# EAGLE design tuner (EAGLE 8.2.2)
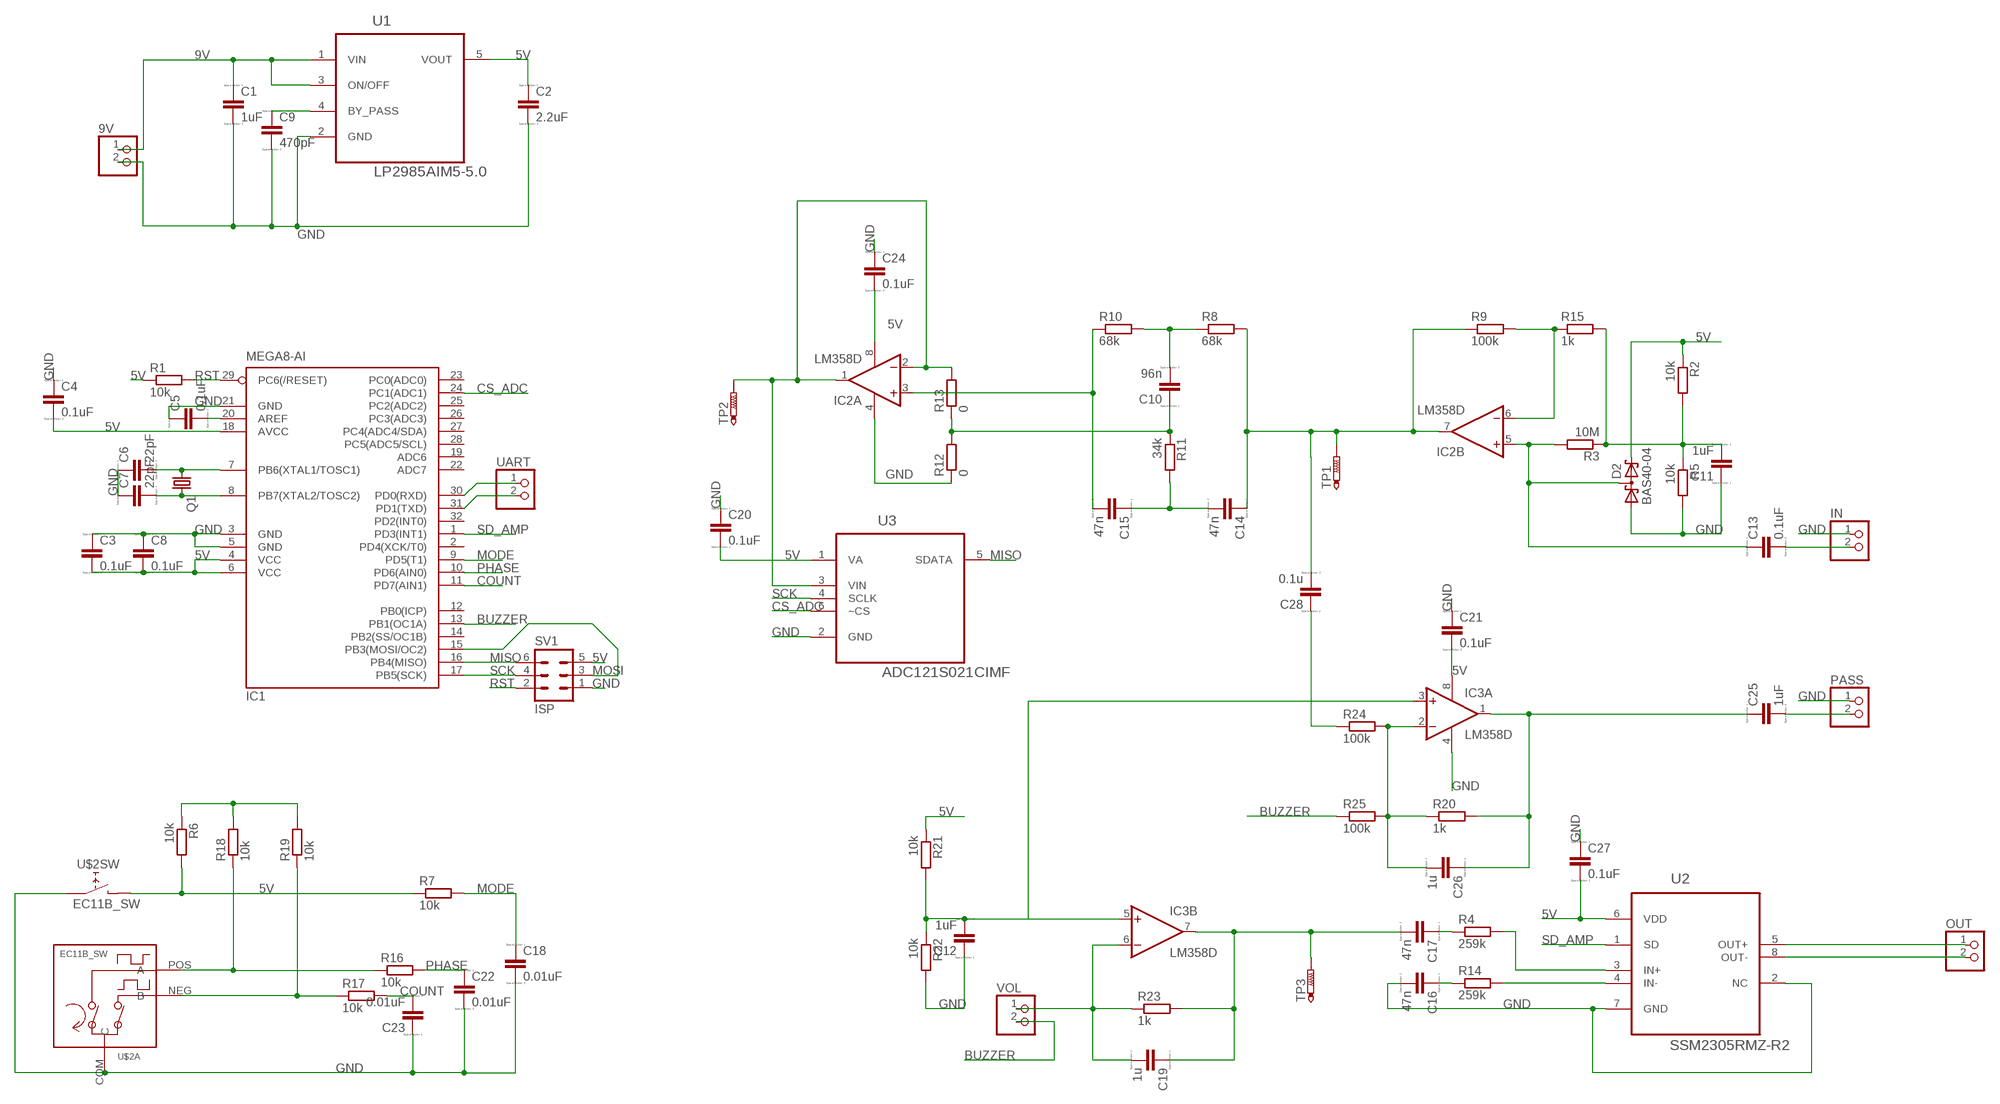
[diagram p0: schematic, sheet 1]

## Parts
9V  PINHD-1X2  [1X02]
C1  1uF  C  [C0805]
C2  2.2uF  C  [C0805]
C3  0.1uF  C  [C0805]
C4  0.1uF  C  [C0805]
C5  0.1uF  C  [C0805]
C6  22pF  C  [C0805]
C7  22pF  C  [C0805]
C8  0.1uF  C  [C0805]
C9  470pF  C  [C0805]
C10  96n  C  [C0805]
C11  1uF  C  [C0805]
C12  1uF  C  [C0805]
C13  0.1uF  C  [C0805]
C14  47n  C  [C0805]
C15  47n  C  [C0805]
C16  47n  C  [C0805]
C17  47n  C  [C0805]
C18  0.01uF  C  [C0805]
C19  1u  C  [C0805]
C20  0.1uF  C  [C0805]
C21  0.1uF  C  [C0805]
C22  0.01uF  C  [C0805]
C23  0.01uF  C  [C0805]
C24  0.1uF  C  [C0805]
C25  1uF  C  [C0805]
C26  1u  C  [C0805]
C27  0.1uF  C  [C0805]
C28  0.1u  C  [C0805]
D2  BAS40-04  [SOT23]
IC1  MEGA8-AI  [TQFP32-08]
IC2  LM358D  [SO08]
IC3  LM358D  [SO08]
IN  PINHD-1X2  [1X02]
OUT  PINHD-1X2  [1X02]
PASS  PINHD-1X2  [1X02]
Q1  CRYSTALHC49S  [HC49/S]
R1  10k  R-EU_M0805  [M0805]
R2  10k  R-EU_M0805  [M0805]
R3  10M  R-EU_M0805  [M0805]
R4  259k  R-EU_M0805  [M0805]
R5  10k  R-EU_M0805  [M0805]
R6  10k  R-EU_M0805  [M0805]
R7  10k  R-EU_M0805  [M0805]
R8  68k  R-EU_M0805  [M0805]
R9  100k  R-EU_M0805  [M0805]
R10  68k  R-EU_M0805  [M0805]
R11  34k  R-EU_M0805  [M0805]
R12  0  R-EU_M0805  [M0805]
R13  0  R-EU_M0805  [M0805]
R14  259k  R-EU_M0805  [M0805]
R15  1k  R-EU_M0805  [M0805]
R16  10k  R-EU_M0805  [M0805]
R17  10k  R-EU_M0805  [M0805]
R18  10k  R-EU_M0805  [M0805]
R19  10k  R-EU_M0805  [M0805]
R20  1k  R-EU_M0805  [M0805]
R21  10k  R-EU_M0805  [M0805]
R22  10k  R-EU_M0805  [M0805]
R23  1k  R-EU_M0805  [M0805]
R24  100k  R-EU_M0805  [M0805]
R25  100k  R-EU_M0805  [M0805]
SV1  ISP  MA03-2  [MA03-2]
TP1  PTR1B1,27  [B1,27]
TP2  PTR1B1,27  [B1,27]
TP3  PTR1B1,27  [B1,27]
U1  LP2985AIM5-5.0  [SOT95P284X119-5N]
U2  SSM2305RMZ-R2  [SOP65P490X110-8N]
U3  ADC121S021CIMF  [SOT95P284X122-6N]
U$2  EC11B_SW  [EC11B]
UART  PINHD-1X2  [1X02]
VOL  PINHD-1X2  [1X02]

## Nets
5V: C2.1 C3.2 C4.2 C8.2 C20.2 C21.2 C24.2 C27.2 D2.2(C2) IC1.4(VCC) IC1.6(VCC) IC1.18(AVCC) IC2.8(P:V+) IC3.8(P:V+) R1.1 R2.1 R6.1 R18.2 R19.2 R21.1 SV1.5 U1.5(VOUT) U2.6(VDD) U3.1(VA)
9V: 9V.1 C1.1 U1.1(VIN) U1.3(ON/OFF)
BUZZER: IC1.13(PB1(OC1A)) R25.1 VOL.2
COUNT: C23.2 IC1.11(PD7(AIN1)) R17.2
CS_ADC: IC1.24(PC1(ADC1)) U3.6(~CS)
FG: C10.1 R11.1 R12.2 R13.1
GND: 9V.2 C1.2 C2.2 C3.1 C4.1 C5.1 C6.1 C7.1 C8.1 C9.2 C11.1 C12.1 C16.2 C18.2 C20.1 C21.1 C22.2 C23.1 C24.1 C27.1 D2.1(A1) IC1.3(GND) IC1.5(GND) IC1.21(GND) IC2.4(P:V-) IC3.4(P:V-) IN.1 PASS.1 R5.2 R12.1 R22.2 SV1.1 U1.2(GND) U2.2(NC) U2.7(GND) U3.2(GND) U$2.COM(A:C) U$2.SW1(SW:D)
MISO: IC1.16(PB4(MISO)) SV1.6 U3.5(SDATA)
MODE: C18.1 IC1.9(PD5(T1)) R7.2
MOSI: IC1.15(PB3(MOSI/OC2)) SV1.3
N$1: C28.1 R24.1
N$2: C9.1 U1.4(BY_PASS)
N$3: C5.2 IC1.20(AREF)
N$4: C6.2 IC1.7(PB6(XTAL1/TOSC1)) Q1.1
N$5: C7.2 IC1.8(PB7(XTAL2/TOSC2)) Q1.2
N$6: C17.2 C19.1 IC3.7(B:OUT) R23.2 TP3.TP
N$7: C19.2 IC3.6(B:-IN) R23.1 VOL.1
N$8: C12.2 IC3.3(A:+IN) IC3.5(B:+IN) R21.2 R22.1
N$9: OUT.1 U2.5(OUT+)
N$10: C14.1 C28.2 IC2.7(B:OUT) R8.2 R9.1 TP1.TP
N$11: OUT.2 U2.8(OUT-)
N$12: C13.2 IN.2
N$13: IC2.6(B:-IN) R9.2 R15.1
N$14: R4.2 U2.3(IN+)
N$15: C25.2 PASS.2
N$16: C13.1 D2.3(C1A2) IC2.5(B:+IN) R3.2
N$17: C11.2 R2.2 R3.1 R5.1 R15.2
N$18: C25.1 C26.1 IC3.1(A:OUT) R20.2
N$19: C14.2 C15.1 R11.2
N$20: C15.2 IC2.3(A:+IN) R10.1
N$21: R14.2 U2.4(IN-)
N$23: R16.1 R18.1 U$2.POS(A:A)
N$24: R17.1 R19.1 U$2.NEG(A:B)
N$26: IC1.30(PD0(RXD)) UART.1
N$27: C10.2 R8.1 R10.2
N$28: IC1.31(PD1(TXD)) UART.2
N$29: C16.1 R14.1
N$30: IC2.1(A:OUT) IC2.2(A:-IN) R13.2 TP2.TP U3.3(VIN)
N$31: C17.1 R4.1
N$32: C26.2 IC3.2(A:-IN) R20.1 R24.2 R25.2
N$35: R6.2 R7.1 U$2.SW2(SW:E)
PHASE: C22.1 IC1.10(PD6(AIN0)) R16.2
RST: IC1.29(PC6(/RESET)) R1.2 SV1.2
SCK: IC1.17(PB5(SCK)) SV1.4 U3.4(SCLK)
SD_AMP: IC1.1(PD3(INT1)) U2.1(SD)
Unconnected: IC1.2(PD4(XCK/T0)) IC1.12(PB0(ICP)) IC1.14(PB2(SS/OC1B)) IC1.19(ADC6) IC1.22(ADC7) IC1.23(PC0(ADC0)) IC1.25(PC2(ADC2)) IC1.26(PC3(ADC3)) IC1.27(PC4(ADC4/SDA)) IC1.28(PC5(ADC5/SCL)) IC1.32(PD2(INT0))

## Library data of the parts
9V IN OUT PASS UART VOL = pinhead:PINHD-1X2: PIN HEADER
C1-C28 = eagle-ltspice:C: CAPACITOR, European symbol; SPICEMODEL: NONE; SPICEPREFIX: C
D2 = diode:BAS40-04: Silicon Schottky Diodes General-purpose diode for high-speed switching
IC1 = atmel:MEGA8: MICROCONTROLLER 8 Kbytes FLASH, 1 kbytes SRAM, 512 bytes EEPROM, USART, 6-channel 10 bit ADC, 2-channel 8 bit ADC Pin compatible with Atmega48, ATMega88, ATMega168 Source: avr.lbr; MPN: ATMEGA8-16AU; OC_FARNELL: 9171371; OC_NEWARK: 73M8863
IC2 IC3 = linear:LM358: OP AMP also LM158; LM258; LM2904 Source: http://cache.national.com/ds/LM/LM158.pdf
Q1 = crystal:CRYSTAL: CRYSTAL; OC_FARNELL: 1667008; OC_NEWARK: unknown
R1-R25 = resistor:R-EU_: RESISTOR, European symbol
SV1 = con-lstb:MA03-2: PIN HEADER; OC_FARNELL: unknown; OC_NEWARK: unknown
TP1-TP3 = testpad:PTR1: TEST PIN
U1 = LP2985AIM5-5.0:LP2985AIM5-5.0: Drop out Regulator; AVAILABILITY: Good; DESCRIPTION: Micropower 150-mA Low-Noise Ultra-Low-Dropout Regulator in SOT-23 and DSBGA Packages 5-SOT-23 -40 to 125; MF: Texas Instruments; MP: LP2985AIM5-5.0/NOPB; PACKAGE: SOT-23-5 Texas Instruments; PRICE: 0.43 USD
U2 = SSM2305RMZ-R2:SSM2305RMZ-R2: Filterless High Efficiency Mono 2.8 W Class-D Audio Amplifier; AVAILABILITY: Warning; DESCRIPTION: IC AMP AUDIO 2.8W MONO D 8MSOP; MF: Analog Devices; MP: SSM2305RMZ-R2; PACKAGE: MSOP-8 Analog Devices; PRICE: 1.47 USD
U3 = ADC121S021CIMF:ADC121S021CIMF: A/D Converters; AVAILABILITY: Good; DESCRIPTION: ADC 12BIT 1CH 50-200KSPS SOT23-6; MF: Texas Instruments; MP: ADC121S021CIMF/NOPB; PACKAGE: SOT-23 Texas Instruments; PRICE: 2.19 USD
U$2 = rotary-encoder:EC11B_SW

## Board
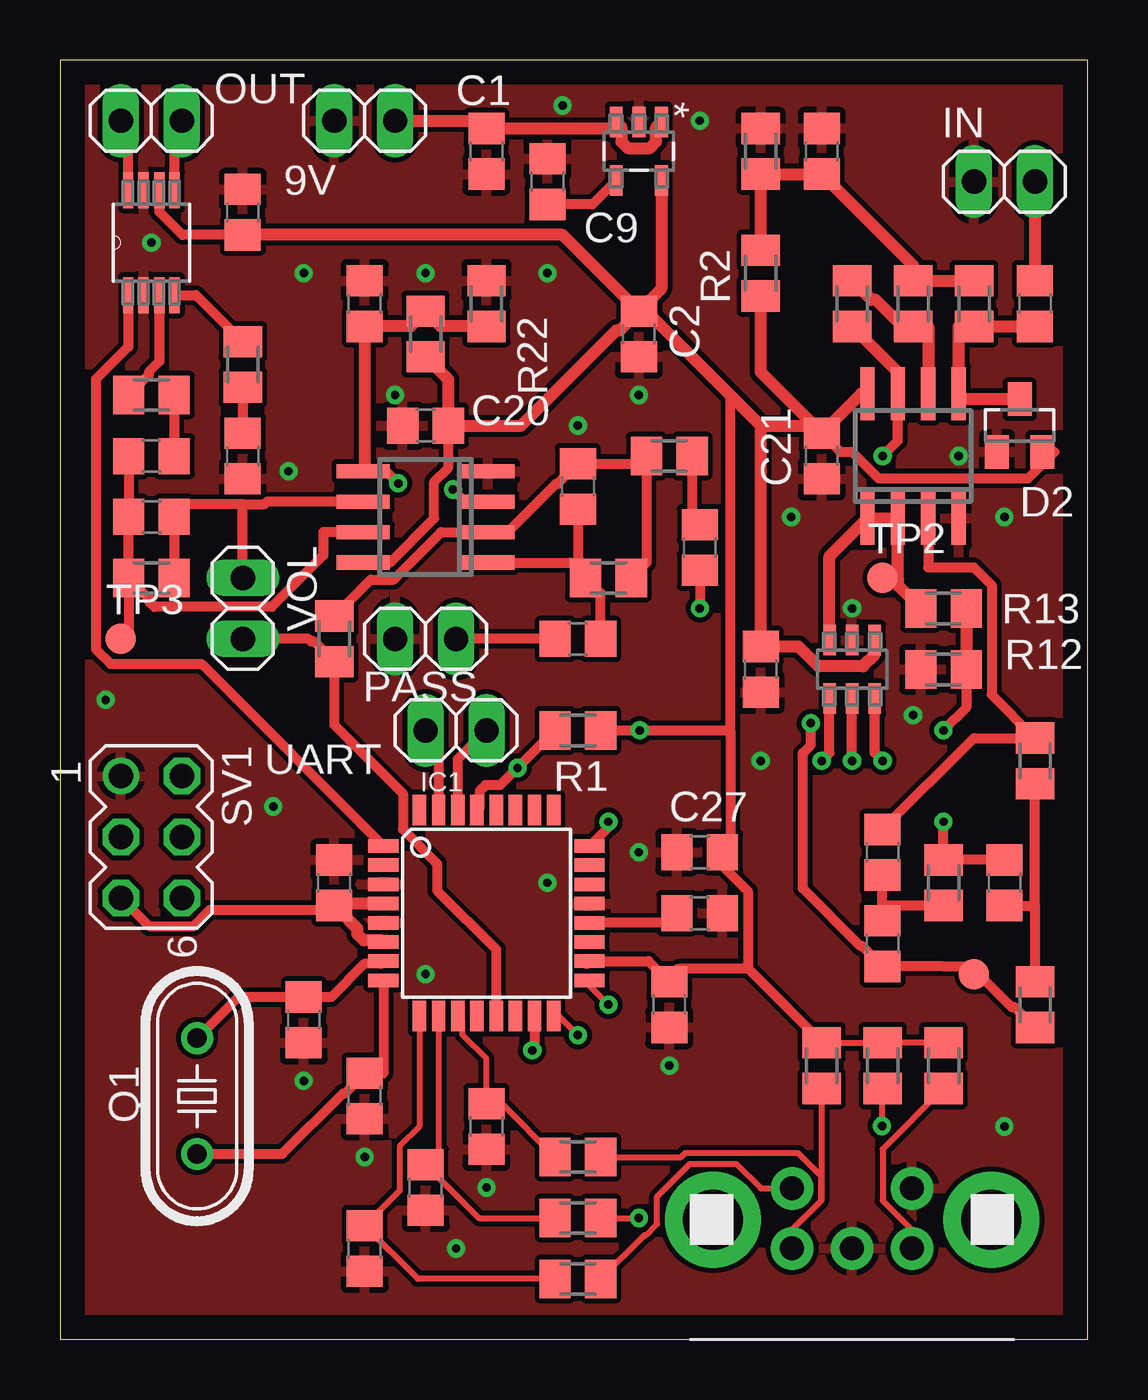
[diagram p1: board, top side]
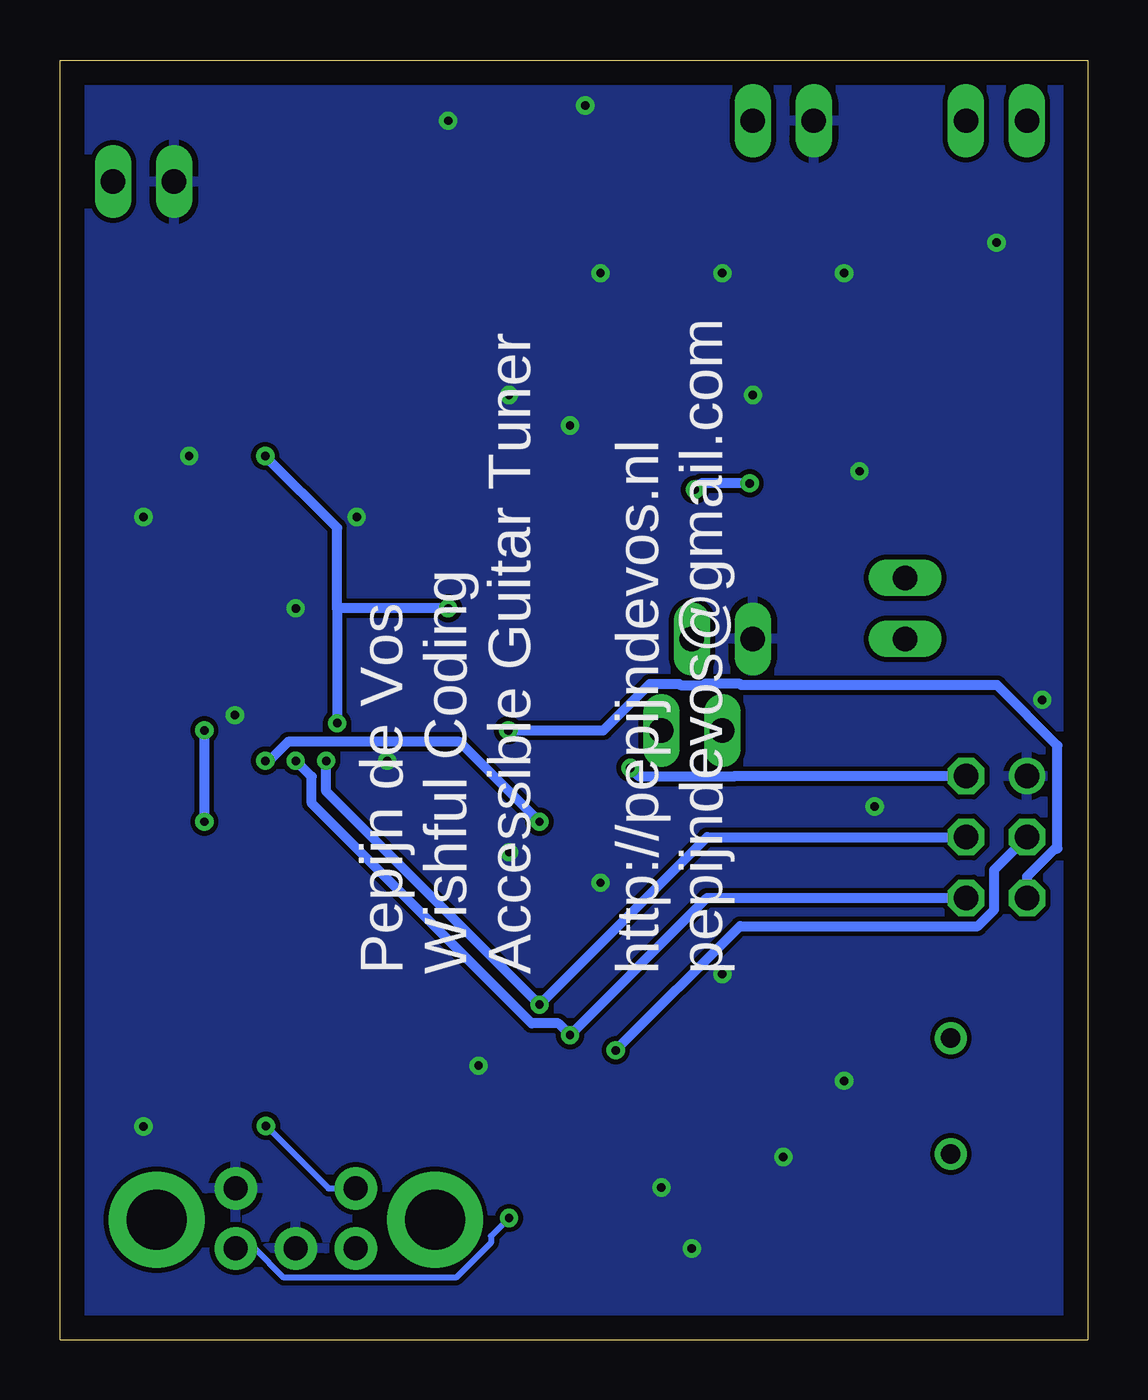
[diagram p2: board, bottom side, seen from below]

Size 42.85 x 53.33 mm. Coordinates in mm from the lower left corner, seen from the top.
Outline: 42.85,0 42.85,53.33 0,53.33 0,0 42.85,0
Copper layers (1*16): Top 0.035mm / dielectric 1.5mm / Bottom 0.035mm
Design rules "default *": minimum track width 10mil, minimum drill 13mil, track to track 8mil, track to pad 8mil, pad to pad 8mil, via to via 8mil, smd to smd 8mil, copper to edge 40mil, drill to drill 8mil, minimum pad ring 10mil, minimum via ring 8mil, stop-mask expansion 4mil, vias tented up to drill 0mil, thermal gap 10mil

### Footprints (pad centres in the part's own frame; a part is rotated, then mirrored left to right if it is on the bottom)
1X02 = drill 1.016 long: 1 -1.27,0; 2 1.27,0
C0805 = smd 1.3 x 1.5: 1 -0.95,0; 2 0.95,0
SOT23 = smd 1 x 1.4: 1 -0.95,-1.1; 2 0.95,-1.1; 3 0,1.1
TQFP32-08 = smd 1.27 x 0.559: 1 -4.293,2.8; 2 -4.293,2; 3 -4.293,1.2; 4 -4.293,0.4; 5 -4.293,-0.4; 6 -4.293,-1.2; 7 -4.293,-2; 8 -4.293,-2.8; 17 4.293,-2.8; 18 4.293,-2; 19 4.293,-1.2; 20 4.293,-0.4; 21 4.293,0.4; 22 4.293,1.2; 23 4.293,2; 24 4.293,2.8 | smd 0.559 x 1.27: 9 -2.8,-4.293; 10 -2,-4.293; 11 -1.2,-4.293; 12 -0.4,-4.293; 13 0.4,-4.293; 14 1.2,-4.293; 15 2,-4.293; 16 2.8,-4.293; 25 2.8,4.293; 26 2,4.293; 27 1.2,4.293; 28 0.4,4.293; 29 -0.4,4.293; 30 -1.2,4.293; 31 -2,4.293; 32 -2.8,4.293
SO08 = smd 0.6 x 2.2: 1 -1.905,-2.6; 2 -0.635,-2.6; 3 0.635,-2.6; 4 1.905,-2.6; 5 1.905,2.6; 6 0.635,2.6; 7 -0.635,2.6; 8 -1.905,2.6
HC49/S = drill 0.813: 1 -2.413,0; 2 2.413,0
M0805 = smd 1.3 x 1.6: 1 -0.95,0; 2 0.95,0
MA03-2 = drill 1.016: 1 -2.54,-1.27 | drill 1.016 octagon: 2 -2.54,1.27; 3 0,-1.27; 4 0,1.27; 5 2.54,-1.27; 6 2.54,1.27
B1,27 = smd 1.27 x 1.27: TP 0,0
SOT95P284X119-5N = smd 1.27 x 0.533: 1 -1.219,0.94; 2 -1.219,0; 3 -1.219,-0.94; 4 1.219,-0.94; 5 1.219,0.94
SOP65P490X110-8N = smd 1.499 x 0.432: 1 -2.184,0.965; 2 -2.184,0.33; 3 -2.184,-0.33; 4 -2.184,-0.965; 5 2.184,-0.965; 6 2.184,-0.33; 7 2.184,0.33; 8 2.184,0.965
SOT95P284X122-6N = smd 1.27 x 0.533: 1 -1.219,0.94; 2 -1.219,0; 3 -1.219,-0.94; 4 1.219,-0.94; 5 1.219,0; 6 1.219,0.94
EC11B = drill 1 pad 1.778: COM 0,0; NEG 0,-2.5; POS 0,2.5; SW1 -2.5,2.5; SW2 -2.5,-2.5 | drill 2.5 pad 4: P$6 -1.2,5.8; P$7 -1.2,-5.8

### Placement (x,y rotation side)
9V  12.7,50.8 180 top
C1  17.78,49.53 270 top
C2  24.13,41.91 270 top
C3  7.62,46.99 270 top
C4  25.4,13.97 90 top
C5  26.67,17.78 180 top
C6  10.16,13.34 90 top
C7  12.7,10.16 90 top
C8  11.43,19.05 270 top
C9  20.32,48.26 90 top
C10  39.37,19.05 270 top
C11  31.75,49.53 270 top
C12  12.7,43.18 270 top
C13  40.64,43.18 90 top
C14  34.29,16.51 90 top
C15  34.29,20.32 90 top
C16  7.62,36.83 270 top
C17  3.81,36.83 180 top
C18  12.7,3.81 270 top
C19  3.81,34.29 0 top
C20  15.24,38.1 0 top
C21  31.75,36.83 90 top
C22  15.24,6.35 270 top
C23  17.78,8.89 90 top
C24  29.21,27.94 90 top
C25  21.59,29.21 180 top
C26  21.59,35.56 90 top
C27  26.67,20.32 0 top
C28  26.67,33.02 270 top
D2  40.01,38.1 0 top
IC1  17.78,17.78 0 top
IC2  35.56,36.83 0 top
IC3  15.24,34.29 90 top
IN  39.37,48.26 0 top
OUT  3.81,50.8 180 top
PASS  15.24,29.21 0 top
Q1  5.71,10.16 270 top
R1  21.59,25.4 180 top
R2  29.21,44.45 90 top
R3  38.1,43.18 270 top
R4  3.81,39.37 180 top
R5  29.21,49.53 90 top
R6  34.29,11.43 270 top
R7  21.59,2.54 180 top
R8  40.64,13.97 270 top
R9  33.02,43.18 90 top
R10  40.64,24.13 270 top
R11  36.83,19.05 270 top
R12  36.83,27.94 0 top
R13  36.83,30.48 180 top
R14  7.62,40.64 90 top
R15  35.56,43.18 90 top
R16  21.59,5.08 180 top
R17  21.59,7.62 180 top
R18  36.83,11.43 90 top
R19  31.75,11.43 90 top
R20  22.86,31.75 180 top
R21  15.24,41.91 90 top
R22  17.78,43.18 90 top
R23  3.81,31.75 180 top
R24  25.4,36.83 180 top
R25  11.43,29.21 90 top
SV1  3.81,20.95 270 top
TP1  38.1,15.24 0 top
TP2  34.29,31.75 0 top
TP3  2.54,29.21 0 top
U1  24.13,49.53 270 top
U2  3.81,45.72 90 top
U3  33.02,27.94 270 top
U$2  33.02,3.81 270 top
UART  16.51,25.4 180 top
VOL  7.62,30.48 270 top

### Tracks (layer width: path | path; a pad name or v marks a point on that pad's centre or on a via)
5V  (via drill 0.35)
  Top 0.254: C8.2 11.51,18.18 | R18.2 R6.1 31.78,12.38 R19.2
  Top 0.406: 13.6,16.69 IC1.6 | U2.6 4.15,47.89 4.15,46.99 5.1,46.04 C3.2 | IC3.8 13.75,32.38 15.6,34.23 15.6,35.76 16.19,36.35 C20.2 | 27.94,25.39 27.94,39.37 | 27.94,25.39 27.94,20.32 C27.2 27.62,19.75 28.68,18.7 28.68,15.48 | 28.68,15.48 31.78,12.38 | 28.68,15.48 25.96,15.48 arc90 C4.2 24.54,15.78 IC1.18 21.96,15.67 | 27.94,25.39 27.93,25.4 v24.16,25.4 R1.1 | C21.2 32.53,37 33.01,37 34.12,35.89 40.36,35.89 41.47,37 D2.2 | 11.62,17.91 6.23,17.91 5.56,17.25 3.71,17.25 SV1.5
  Top 0.508: IC1.6 13.42,16.64 12.66,16.64 12.4,16.91 12.4,17.13 11.62,17.91 C8.2 | IC1.4 11.51,18.18 | U1.5 25.07,43.8 C2.1 | C2.1 20.95,46.04 C3.2 | C21.2 33.4,39.43 IC2.8 | C21.2 29.21,40.32 R2.1 | C2.1 23.34,42.07 23.19,42.07 19.22,38.1 C20.2 16.19,40.01 R21.1 | C2.1 24.45,42.86 27.94,39.37 29.21,38.1 | 29.21,38.1 C24.2 30.8,28.89 31.62,28.07 33.48,28.07 33.96,28.55 U3.1 | 29.21,38.1 31.43,38.1 C21.2
  Bottom 0.406: v24.16,25.4 20.19,25.4 18.26,27.33 17.05,27.33 16.99,27.28 16.03,27.28 15.98,27.33 14.51,27.33 14.45,27.28 3.79,27.28 1.27,24.77 1.27,20.47 1.37,20.47 2.54,19.3 SV1.5
9V
  Top 0.508: 9V.1 17.46,50.8 C1.1 22.92,50.48 U1.3 23.41,50.53 23.41,49.92 23.67,49.66 24.59,49.66 24.85,49.92 24.85,50.53 U1.1
BUZZER
  Top 0.406: VOL.2 10.36,29.21 10.46,29.1 10.59,29.1 R25.1 11.43,25.62 14.29,22.76 14.29,21.27 15.73,19.84 15.73,18.73 18.18,16.27 IC1.13
COUNT
  Top 0.254: IC1.11 16.77,13.3 16.77,12.72 17.78,11.71 C23.2 18.42,9.84 R17.2
CS_ADC  (via drill 0.35)
  Top 0.406: IC1.24 22.86,21.37 v22.86,21.59 | v34.29,24.13 33.96,24.46 U3.6
  Bottom 0.406: v34.29,24.13 34.13,24.13 33.34,24.91 26.19,24.91 v22.86,21.59
FG  (via drill 0.35)
  Top 0.406: C10.1 R11.1 v36.83,21.59 | R12.2 37.78,26.35 v36.83,25.4
  Top 0.508: R13.1 R12.2
  Bottom 0.406: v36.83,25.4 v36.83,21.59
GND  (via drill 0.35)
  other vias: 17.78,6.35 25.4,11.43 39.37,34.29 37.47,36.83 30.48,34.29 3.81,45.72 15.24,44.45 13.97,39.37 24.13,39.37 21.59,38.1 26.67,50.8 20.32,44.45 10.16,44.45 8.89,22.23 15.24,15.24 20.32,19.05 16.51,3.81 33.02,30.48 29.21,24.13 39.37,8.89 20.95,51.44 1.91,26.67 24.13,20.32 35.56,26.03 9.52,36.2 10.16,10.8 12.7,7.62
  pour Top: 0,53.34 43.18,53.34 43.18,0 0,0
  pour Bottom: 0,53.34 43.18,53.34 43.18,0 0,0
MISO  (via drill 0.35)
  Top 0.254: IC1.16 20.8,13.49 v21.59,12.7
  Top 0.406: v33.02,24.13 U3.5
  Bottom 0.406: v33.02,24.13 32.36,23.47 32.36,22.36 23.19,13.18 22.08,13.18 v21.59,12.7 15.88,18.41 SV1.6
MODE
  Top 0.254: IC1.9 14.98,8.91 14.16,8.09 14.16,6.22 C18.1 14.92,2.54 R7.2
MOSI  (via drill 0.35)
  Top 0.406: IC1.15 19.78,12.16 v19.69,12.06
  Bottom 0.406: v19.69,12.06 14.5,17.25 4.6,17.25 3.91,17.93 3.91,19.58 SV1.3
N$1
  Top 0.406: R24.1 26.35,34.29 C28.1
N$2
  Top 0.406: U1.4 22.19,47.31 C9.1
N$3
  Top 0.406: C5.2 25.32,17.38 IC1.20
N$4
  Top 0.406: Q1.1 7.43,14.28 C6.2 11.3,14.28 12.68,15.67 13.37,15.67 IC1.7
N$5
  Top 0.406: IC1.8 13.49,11.11 C7.2 11.86,10.27 11.78,10.27 9.26,7.75 Q1.2
N$6
  Top 0.406: C17.2 C19.1 R23.2 | R23.2 2.86,29.53 TP3.TP | R23.2 3.7,30.91 3.7,30.78 3.94,30.54 8.83,30.54 10.97,32.69 10.97,33.66 IC3.7
N$7
  Top 0.406: R23.1 C19.2 5.29,34.82 7.62,34.82 | IC3.6 8.64,34.92 8.54,34.82 7.62,34.82 | VOL.1 7.62,34.82
N$8  (via drill 0.35)
  Top 0.406: IC3.5 13.59,36.2 v14.1,35.69 | v16.38,35.43 16.89,34.92 IC3.3
  Top 0.508: R22.1 15.87,42.23 R21.2 14.61,42.23 C12.2 12.7,36.25 IC3.5
  Bottom 0.406: v14.1,35.69 16.12,35.69 v16.38,35.43
N$9
  Top 0.406: U2.5 4.78,50.5 OUT.1
N$10  (via drill 0.35)
  Top 0.406: 37.98,15.56 36.83,15.56 C14.1 33.45,16.4 33.37,16.4 30.97,18.81 30.97,24.45 31.3,24.78 v31.3,25.7 | R8.2 39.8,13.86 39.67,13.86 37.98,15.56 | 37.98,15.56 38.1,15.56 TP1.TP | C28.2 v26.67,30.48 | v34.29,36.83 34.92,37.47 IC2.7
  Top 0.508: R9.1 34.92,40.33 IC2.7
  Bottom 0.406: 31.3,30.43 v31.3,25.7 | 31.3,30.43 31.3,33.84 v34.29,36.83 | v26.67,30.48 31.25,30.48 31.3,30.43
N$11
  Top 0.406: U2.8 2.84,50.5 OUT.2
N$12
  Top 0.508: IN.2 C13.2
N$13
  Top 0.508: IC2.6 36.2,42.23 R15.1 35.12,42.23 34.01,43.34 33.81,43.34 R9.2
N$14
  Top 0.406: R4.2 3.7,40.21 3.7,40.34 4.14,40.77 U2.3
N$15
  Top 0.406: C25.2 PASS.2
N$16
  Top 0.508: C13.1 R3.2 37.47,42.23 IC2.5 37.7,39.2 D2.3
N$17
  Top 0.508: R2.2 R5.1 C11.2 35.56,44.77 R15.2 R3.1
N$18
  Top 0.406: C26.1 21.59,32.07 R20.2 | IC3.1 21.27,32.38 R20.2 | C25.1 22.54,31.12 R20.2
N$19
  Top 0.406: 34.29,18.1 C14.2 | R11.2 34.29,18.1 | 34.29,18.1 C15.1
N$20
  Top 0.406: IC2.3 36.2,32.19 38.09,32.19 38.84,31.45 38.84,26.88 R10.1 38.1,25.08 C15.2
N$21
  Top 0.406: U2.4 5.67,43.54 R14.2
N$23  (via drill 0.35)
  Top 0.254: U$2.POS 35.52,4.59 34.3,5.8 34.3,7.95 R18.1 | R16.1 v24.13,5.08
  Bottom 0.254: v24.13,5.08 24.89,4.32 24.89,4.04 26.34,2.59 33.52,2.59 34.74,3.81 U$2.POS
N$24
  Top 0.254: 31.74,5.9 31.74,6.81 30.76,7.8 26.06,7.8 25.89,7.62 R17.1 | 31.74,5.9 31.74,5.8 30.52,4.59 U$2.NEG | R19.1 31.74,10.47 31.74,5.9
N$26
  Top 0.406: UART.1 16.58,24.2 IC1.30
N$27
  Top 0.406: 40.64,17.81 R10.2 | 40.64,17.81 R8.1 | C10.2 40.64,18.1 40.64,17.81
N$28
  Top 0.406: UART.2 15.78,24.86 IC1.31
N$29
  Top 0.406: R14.1 C16.1
N$30
  Top 0.508: U3.3 32.08,32.66 IC2.1 IC2.2 34.92,31.73 | 34.92,31.73 34.92,31.43 R13.2 | TP2.TP 34.91,31.75 34.92,31.73
N$31
  Top 0.406: R4.1 C17.1
N$32
  Top 0.406: R25.2 12.95,31.68 13.91,31.68 15.88,33.66 IC3.2 18.66,33.66 20.67,35.67 20.75,35.67 C26.2 24.13,36.51 R24.2 24.45,32.39 R20.1
N$35  (via drill 0.35)
  Top 0.254: 30.52,6.71 U$2.SW2 29.22,6.31 28.19,7.34 26.26,7.34 24.89,5.98 24.89,4.84 24.42,4.37 24.37,4.37 R7.1 | R6.2 34.26,10.45 v34.26,8.92
  Bottom 0.254: v34.26,8.92 31.66,6.31 U$2.SW2
PHASE
  Top 0.254: IC1.10 15.78,7.84 C22.1 17.46,5.08 R16.2
RST  (via drill 0.35)
  Top 0.406: IC1.29 17.49,22.19 17.49,22.88 17.73,23.11 18.35,23.11 v19.07,23.83 R1.2
  Bottom 0.406: SV1.2 14.73,23.49 14.76,23.47 18.71,23.47 v19.07,23.83
SCK  (via drill 0.35)
  Top 0.254: IC1.17 22.07,14.76 v22.86,13.97
  Top 0.406: v31.75,24.13 32.08,24.46 U3.4
  Bottom 0.406: v31.75,24.13 31.75,22.86 v22.86,13.97 15.88,20.95 SV1.4
SD_AMP
  Top 0.406: U2.1 2.84,41.38 1.5,40.03 1.5,28.78 2.11,28.17 5.9,28.17 IC1.1

### Text on the board
bPlace: Pepijn de Vos / Wishful Coding / Accessible Guitar Tuner / / http://pepijndevos.nl / pepijndevos@gmail.com